# EAGLE schematic single_board_voice_changer (EAGLE 7.1.0)
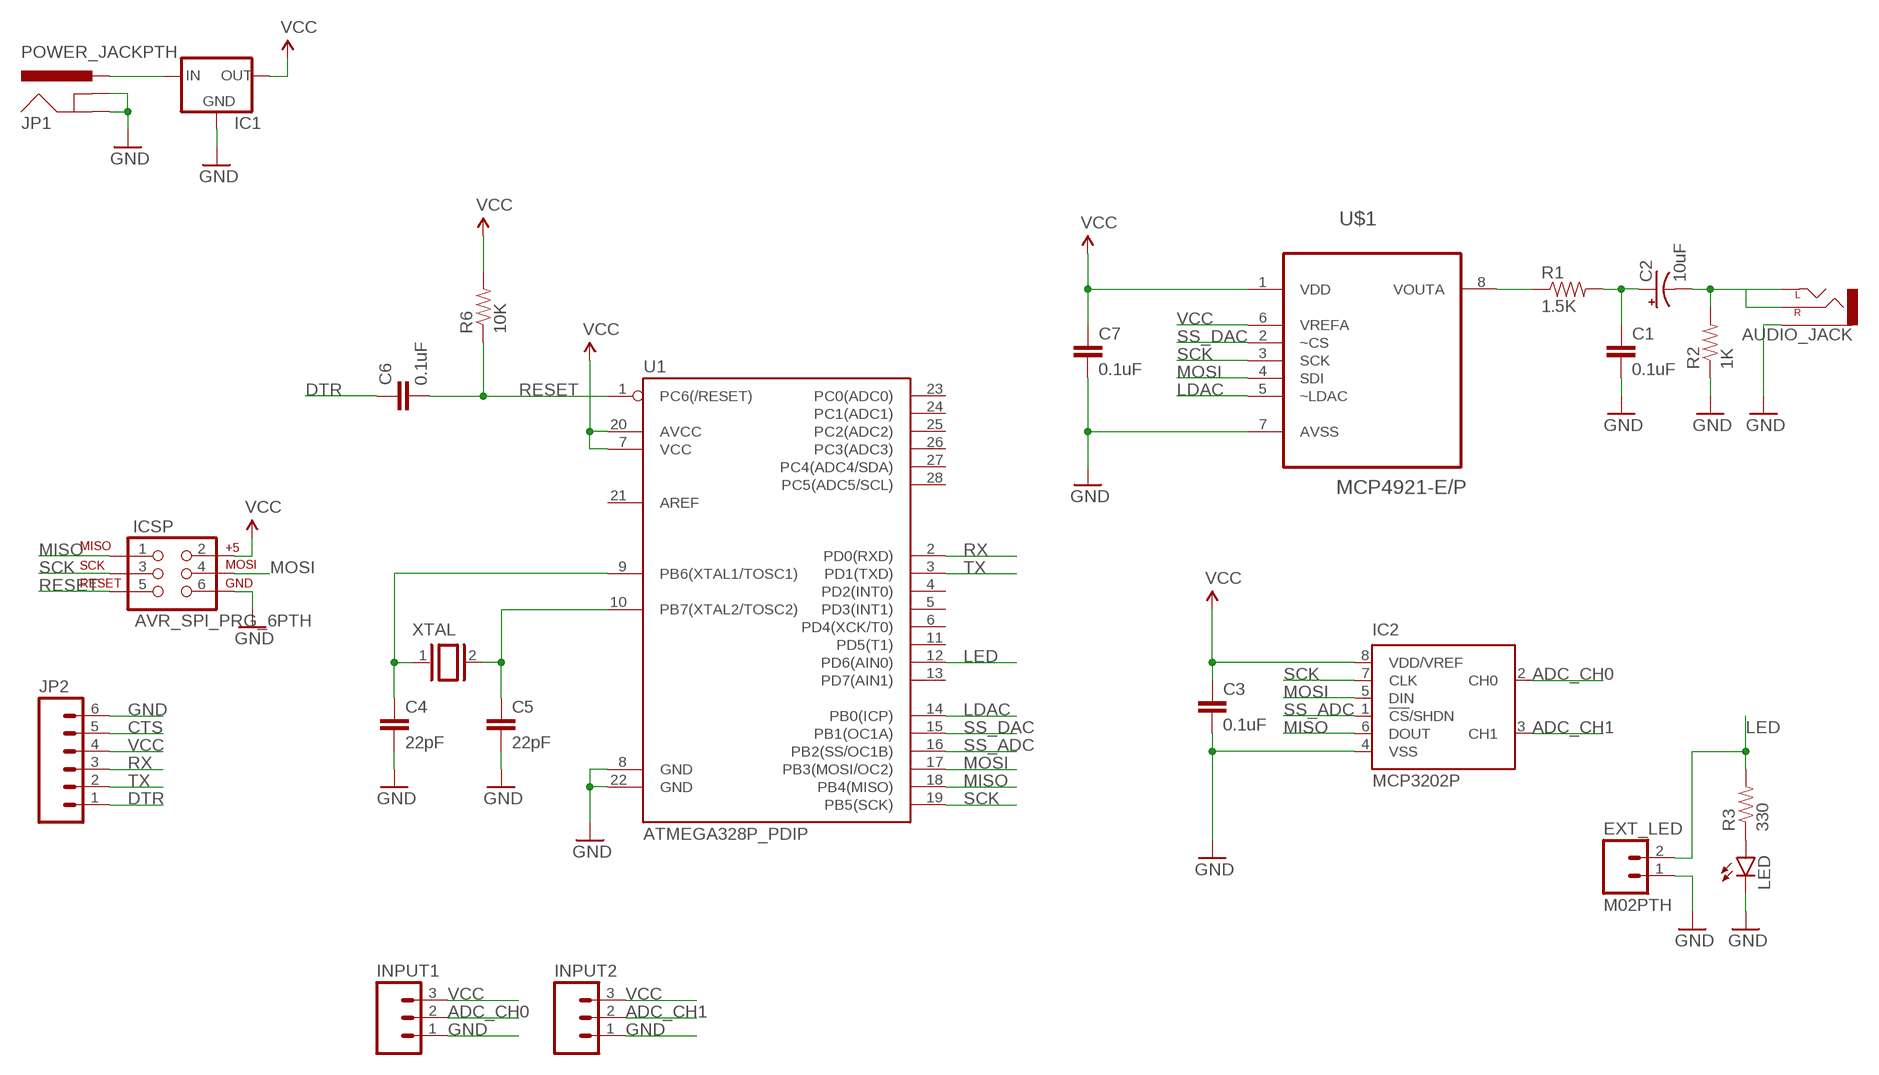
[diagram p0: schematic, sheet 1]

## Parts
AUDIO_JACK  AUDIO-JACKPTH  [AUDIO-JACK]
C1  0.1uF  CAPPTH  [CAP-PTH-SMALL]
C2  10uF  CAP_POLPTH2  [CPOL-RADIAL-10UF-25V]
C3  0.1uF  CAPPTH  [CAP-PTH-SMALL]
C4  22pF  CAPPTH  [CAP-PTH-SMALL]
C5  22pF  CAPPTH  [CAP-PTH-SMALL]
C6  0.1uF  CAPPTH  [CAP-PTH-SMALL]
C7  0.1uF  CAPPTH  [CAP-PTH-SMALL]
EXT_LED  M02PTH  [1X02]
IC1  V_REG_78XXSIDE  [78XXL]
IC2  MCP3202P  [DIL8]
ICSP  AVR_SPI_PRG_6PTH  [2X3]
INPUT1  M03PTH  [1X03]
INPUT2  M03PTH  [1X03]
JP1  POWER_JACKPTH  [POWER_JACK_PTH]
JP2  M06SILK_FEMALE_PTH  [1X06]
LED  LED5MM  [LED5MM]
R1  1.5K  RESISTORPTH-1/4W  [AXIAL-0.4]
R2  1K  RESISTORPTH-1/4W  [AXIAL-0.4]
R3  330  RESISTORPTH-1/4W  [AXIAL-0.4]
R6  10K  RESISTORPTH-1/4W  [AXIAL-0.4]
U1  ATMEGA328P_PDIP  [DIL28-3]
U$1  MCP4921-E/P  [DIP254P762X432-8]
XTAL  XTAL/S  [QS]

## Nets
ADC_CH0: IC2.2(CH0) INPUT1.2
ADC_CH1: IC2.3(CH1) INPUT2.2
CTS: JP2.5
DTR: C6.1 JP2.1
GND: AUDIO_JACK.SLEEVE C1.2 C3.2 C4.2 C5.2 C7.2 EXT_LED.1 IC1.GND IC2.4(VSS) ICSP.6 INPUT1.1 INPUT2.1 JP1.GND JP1.GNDBREAK JP2.6 LED.K(C) R2.P$1 U1.8(GND) U1.22(GND) U$1.7(AVSS)
LDAC: U1.14(PB0(ICP)) U$1.5(~LDAC)
LED: EXT_LED.2 R3.P$2 U1.12(PD6(AIN0))
MISO: IC2.6(DOUT) ICSP.1 U1.18(PB4(MISO))
MOSI: IC2.5(DIN) ICSP.4 U1.17(PB3(MOSI/OC2)) U$1.4(SDI)
N$1: R1.P$1 U$1.8(VOUTA)
N$2: C1.1 C2.1(+) R1.P$2
N$3: LED.A R3.P$1
N$4: IC1.IN JP1.PWR
N$5: C4.1 U1.9(PB6(XTAL1/TOSC1)) XTAL.1
N$8: C5.1 U1.10(PB7(XTAL2/TOSC2)) XTAL.2
N$10: AUDIO_JACK.RING(RIGHT) AUDIO_JACK.TIP(LEFT) C2.2(-) R2.P$2
RESET: C6.2 ICSP.5 R6.P$1 U1.1(PC6(/RESET))
RX: JP2.3 U1.2(PD0(RXD))
SCK: IC2.7(CLK) ICSP.3 U1.19(PB5(SCK)) U$1.3(SCK)
SS_ADC: IC2.1(!CS!/SHDN) U1.16(PB2(SS/OC1B))
SS_DAC: U1.15(PB1(OC1A)) U$1.2(~CS)
TX: JP2.2 U1.3(PD1(TXD))
VCC: C3.1 C7.1 IC1.OUT IC2.8(VDD/VREF) ICSP.2 INPUT1.3 INPUT2.3 JP2.4 R6.P$2 U1.7(VCC) U1.20(AVCC) U$1.1(VDD) U$1.6(VREFA)
Unconnected: U1.4(PD2(INT0)) U1.5(PD3(INT1)) U1.6(PD4(XCK/T0)) U1.11(PD5(T1)) U1.13(PD7(AIN1)) U1.21(AREF) U1.23(PC0(ADC0)) U1.24(PC1(ADC1)) U1.25(PC2(ADC2)) U1.26(PC3(ADC3)) U1.27(PC4(ADC4/SDA)) U1.28(PC5(ADC5/SCL))

## Library data of the parts
AUDIO_JACK = SparkFun-Connectors:AUDIO-JACK: 3.5mm Audio Jack Simple 3.5mm common PCB mount audio jack. SKU: PRT-08032
C1 C3-C5 C7 = SparkFun-Passives:CAP: Capacitor Standard 0603 ceramic capacitor, and 0.1" leaded capacitor.
C2 = SparkFun-Passives:CAP_POL: Capacitor Polarized These are standard SMD and PTH capacitors. Normally 10uF, 47uF, and 100uF in electrolytic and tantalum varieties. Always verify the external diameter of the through hole cap, it varies with capacity, voltage, and manufacturer. The EIA devices should be standard.
C6 = SparkFun-Capacitors:CAP: Capacitor Standard 0603 ceramic capacitor, and 0.1" leaded capacitor.
EXT_LED = SparkFun-Connectors:M02: Standard 2-pin 0.1" header. Use with - straight break away headers ( PRT-00116) - right angle break away headers (PRT-00553) - swiss pins (PRT-00743) - machine pins (PRT-00117) - female headers (PRT-00115) Molex polarized connector foot print use with: PRT-08233 with associated crimp pins and housings. 2.54_SCREWTERM for use with PRT-10571. 3.5mm Screw Terminal footprints for PRT-08084 5mm Screw Terminal footprints for use with PRT-08432
IC1 = SparkFun-PowerIC:V_REG_78XX: Voltage Regulator Standard 7805 5V regulator. IGO (Input Ground Output). Spark Fun Electronics SKU : COM-00107
IC2 = microchip:MCP3202: 2.7V Dual Channel 12-Bit A/D Converter with SPI Serial Interface Source: http://ww1.microchip.com/downloads/en/DeviceDoc/21034D.pdf; MF: MICROCHIP; MPN: MCP3202-CI/P; OC_FARNELL: 1196794; OC_NEWARK: 72K7287
ICSP = SparkFun-Connectors:AVR_SPI_PRG_6: AVR ISP 6 Pin This is the reduced ISP connector for AVR programming. Common on Arduino. This footprint will take up less PCB space and can be used with a 10-pin to 6-pin adapter such as SKU: BOB-08508 **Special note about "TEST_POINT" package. The stop mask is on the top side, so if you want your programming test points to be on the bottom of your board, make sure to place this package on the bottom side of the board. This also ensure that the orientation to program from the bottom side will be correct.
INPUT1 INPUT2 = SparkFun-Connectors:M03: Header 3 Standard 3-pin 0.1" header. Use with straight break away headers (SKU : PRT-00116), right angle break away headers (PRT-00553), swiss pins (PRT-00743), machine pins (PRT-00117), and female headers (PRT-00115). Molex polarized connector foot print use with SKU : PRT-08232 with associated crimp pins and housings.
JP1 = SparkFun-Connectors:POWER_JACK: Power Jack This is the standard 5.5mm barrel jack for power. The PTH is the most common, proven, reliable, footprint. The Slot footprint only works if the mill layer is transmitted to the PCB fab house so be warned. Mating wall wart : TOL-00298 (and others); PROD_ID: CONN-08197
JP2 = SparkFun-Connectors:M06: Header 6 Standard 6-pin 0.1" header. Use with straight break away headers (SKU : PRT-00116), right angle break away headers (PRT-00553), swiss pins (PRT-00743), machine pins (PRT-00117), and female headers (PRT-00115). Molex polarized connector foot print use with SKU : PRT-08094 with associated crimp pins and housings. NOTES ON THE VARIANTS LOCK and LOCK_LONGPADS... This footprint was designed to help hold the alignment of a through-hole component (i.e. 6-pin header) while soldering it into place. You may notice that each hole has been shifted either up or down by 0.005 of an inch from it's more standard position (which is a perfectly straight line). This slight alteration caused the pins (the squares in the middle) to touch the edges of the holes. Because they are alternating, it causes a "brace" to hold the component in place. 0.005 has proven to be the perfect amount of "off-center" position when using our standard breakaway headers. Although looks a little odd when you look at the bare footprint, once you have a header in there, the alteration is very hard to notice. Also,if you push a header all the way into place, it is covered up entirely on the bottom side. This idea of altering the position of holes to aid alignment will be further integrated into the Sparkfun Library for other footprints. It can help hold any component with 3 or more connection pins.; PROD_ID: CONN-08437
LED = SparkFun-LED:LED: LEDs Standard schematic elements and footprints for 5mm, 3mm, 1206, and 0603 sized LEDs. 5mm - Spark Fun Electronics SKU : COM-00529 (and others)
R1-R3 R6 = SparkFun-Passives:RESISTOR: Resistor Basic schematic elements and footprints for 0603, 1206, and PTH resistors.
U1 = SparkFun-DigitalIC:ATMEGA328P_PDIP: uC used in the Arduino 32kb flash, 1k EEPROM, 2k SRAM This is the through-hole version of this chip.
U$1 = Microchip_By_element14_Batch_1:MCP4921-E/P: DAC; MPN: MCP4921-E/P; OC_FARNELL: 1332112; OC_NEWARK: 08J8743; PACKAGE: DIP-8; SUPPLIER: Microchip
XTAL = special:XTAL/S: CRYSTAL